# EAGLE schematic Baby_TX_Mod (EAGLE 6.4)
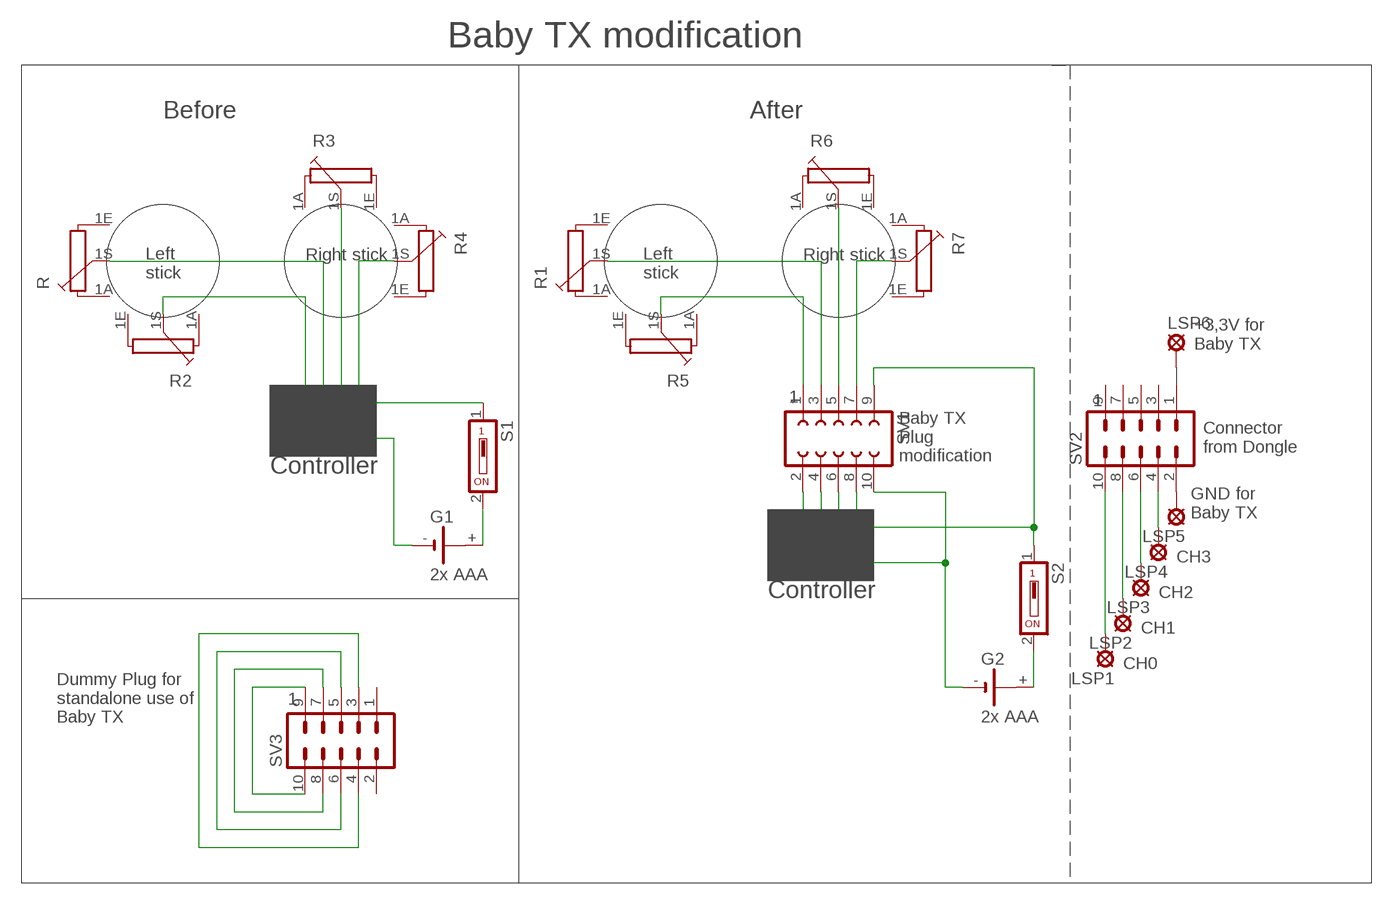
[diagram p0: schematic, sheet 1]

## Parts
G1  2x AAA  CR2032H  [CR2032H]
G2  2x AAA  CR2032H  [CR2032H]
LSP1  LSP10  [LSP10]
LSP2  LSP10  [LSP10]
LSP3  LSP10  [LSP10]
LSP4  LSP10  [LSP10]
LSP5  LSP10  [LSP10]
LSP6  LSP10  [LSP10]
R  PC16S  [PC16S]
R1  PC16S  [PC16S]
R2  PC16S  [PC16S]
R3  PC16S  [PC16S]
R4  PC16S  [PC16S]
R5  PC16S  [PC16S]
R6  PC16S  [PC16S]
R7  PC16S  [PC16S]
S1  SD4-01  [SD4-01]
S2  SD4-01  [SD4-01]
SV1  FE05-2  [FE05-2]
SV2  MA05-2  [MA05-2]
SV3  MA05-2  [MA05-2]

## Nets
N$1: R4.1S
N$2: R3.1S
N$3: R2.1S
N$4: R.1S
N$5: R7.1S SV1.7
N$6: R6.1S SV1.5
N$7: R5.1S SV1.1
N$8: R1.1S SV1.3
N$9: SV1.2
N$10: SV1.4
N$11: SV1.6
N$12: SV1.8
N$13: LSP1.MP SV2.10
N$14: G1.+ S1.2
N$15: G1.-
N$16: S1.1
N$17: G2.+ S2.2
N$18: G2.- SV1.10
N$19: S2.1 SV1.9
N$20: LSP2.MP SV2.8
N$21: LSP3.MP SV2.6
N$22: LSP4.MP SV2.4
N$23: LSP5.MP SV2.2
N$24: SV3.9 SV3.10
N$25: SV3.7 SV3.8
N$26: SV3.5 SV3.6
N$27: SV3.3 SV3.4
Unconnected: G1.+@1(+) G2.+@1(+) LSP6.MP R1.1A R1.1E R2.1A R2.1E R3.1A R3.1E R4.1A R4.1E R5.1A R5.1E R6.1A R6.1E R7.1A R7.1E R.1A R.1E SV2.1 SV2.3 SV2.5 SV2.7 SV2.9 SV3.1 SV3.2

## Notes on the sheet
- Baby TX modification
- Before | After
- Right stick | Right stick
- Left
  stick
- Left
  stick
- +3,3V for
  Baby TX
- 1 | 1
- Connector
  from Dongle
- Baby TX
  Plug 
  modification
- Controller
- GND for
  Baby TX
- CH3
- Controller | CH2
- CH1
- CH0
- 1
- Dummy Plug for
  standalone use of
  Baby TX

## Library data of the parts
G1 G2 = battery:CR2032H: LI BATTERY Varta
LSP1-LSP6 = solpad:LSP10: SOLDER PAD drill 1.0 mm, distributor Buerklin, 12H555
R R1-R7 = piher:PC16S: POTENTIOMETER single carbon potentiometer, 16 mm, S3ROH
S1 S2 = switch-dil:SD4-01: DIL/CODE SWITCH
SV1 = con-lsta:FE05-2: FEMALE HEADER
SV2 SV3 = con-lstb:MA05-2: PIN HEADER